# Altium schematic sheet Mircod_TEST_LIST_MAIN.SchDoc
size A4
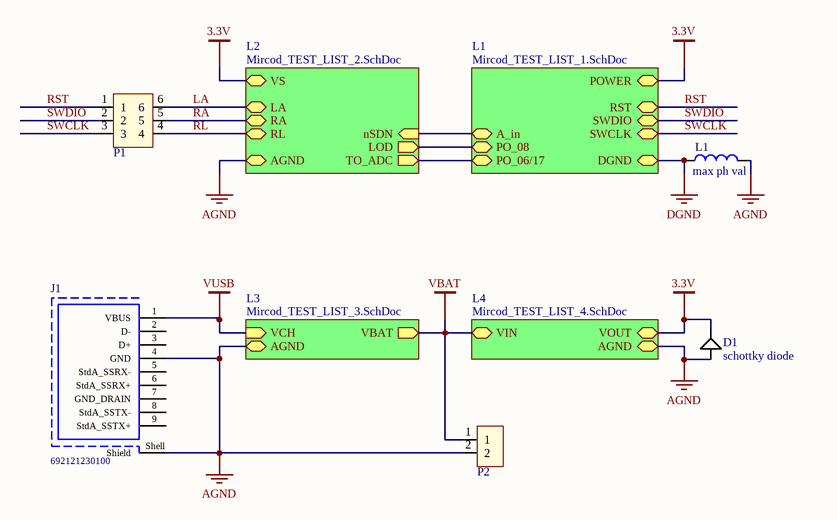
[diagram p0: Mircod_TEST_LIST_MAIN.SchDoc]

## Parts
D1  schottky diode  [DSMD_0603]
J1  692121230100  [692121230100]
L1  max ph val  [RDSMD_0603]
P1  PORT  [H_3X2_1_27]  (value not drawn)
P2  Header 1x2  [header-2]  (value not drawn)

## Sub-sheets
L1 = Mircod_TEST_LIST_1.SchDoc: RST, SWDIO, SWCLK, POWER, DGND, A_in, PO_08, PO_06/17
L2 = Mircod_TEST_LIST_2.SchDoc: RA, RL, LA, nSDN (in), LOD (out), TO_ADC (out), VS (bidir), AGND (bidir)
L3 = Mircod_TEST_LIST_3.SchDoc: VBAT (out), VCH (in), AGND
L4 = Mircod_TEST_LIST_4.SchDoc: VOUT, AGND, VIN

## Nets
3.3V: D1.2 ; sheet L2/VS, sheet L1/POWER, sheet L4/VOUT
AGND: D1.1 J1.4(GND) J1.Shell(Shield) L1.1 P2.2 ; sheet L2/AGND, sheet L3/AGND, sheet L4/AGND
DGND: L1.2 ; sheet L1/DGND
VBAT: P2.1 ; sheet L3/VBAT, sheet L4/VIN
VUSB: J1.1(VBUS) ; sheet L3/VCH
LA: P1.6 ; sheet L2/LA
RA: P1.5 ; sheet L2/RA
RL: P1.4 ; sheet L2/RL
RST: P1.1 ; sheet L1/RST
SWCLK: P1.3 ; sheet L1/SWCLK
SWDIO: P1.2 ; sheet L1/SWDIO
(unnamed): sheet L2/nSDN, sheet L1/A_in
(unnamed): sheet L2/LOD, sheet L1/PO_08
(unnamed): sheet L2/TO_ADC, sheet L1/PO_06/17

Not connected (* = marked no-connect by the designer): J1 2(D-) 3(D+) 5(StdA_SSRX-) 6(StdA_SSRX+) 7(GND_DRAIN) 8(StdA_SSTX-) 9(StdA_SSTX+)

## Library data of the parts
D1 = DIODE
J1 = 692121230100: USB 3.0 Type A Receptacle WR-COM, Horizontal, THT, with Clips, with 1.04 mm Offset; Rated Current: 0.25 A; Contact Resistance: 50 mOhm; Working Voltage: 30 VAC; ComponentLink1Description: Manufacturer; ComponentLink1URL: http://www.we-online.de; ComponentLink2Description: Datasheet; ComponentLink2URL: https://katalog.we-online.de/em/datasheet/692121230100.pdf; Part Number: 692121230100; Published Date: September 2018; Publisher: Wurth Elektronik; Orientation: Horizontal; Connector Type: USB 3.0 Type A; Operating Temperature: -20 to 85 degC; Mounting Technology: THT; Gender: Receptacle; Packaging: Tape and Reel
L1 = INDUCTOR